# Altium schematic sheet ADC.SchDoc
size A4; SheetNumber: 4; SheetTotal: 8
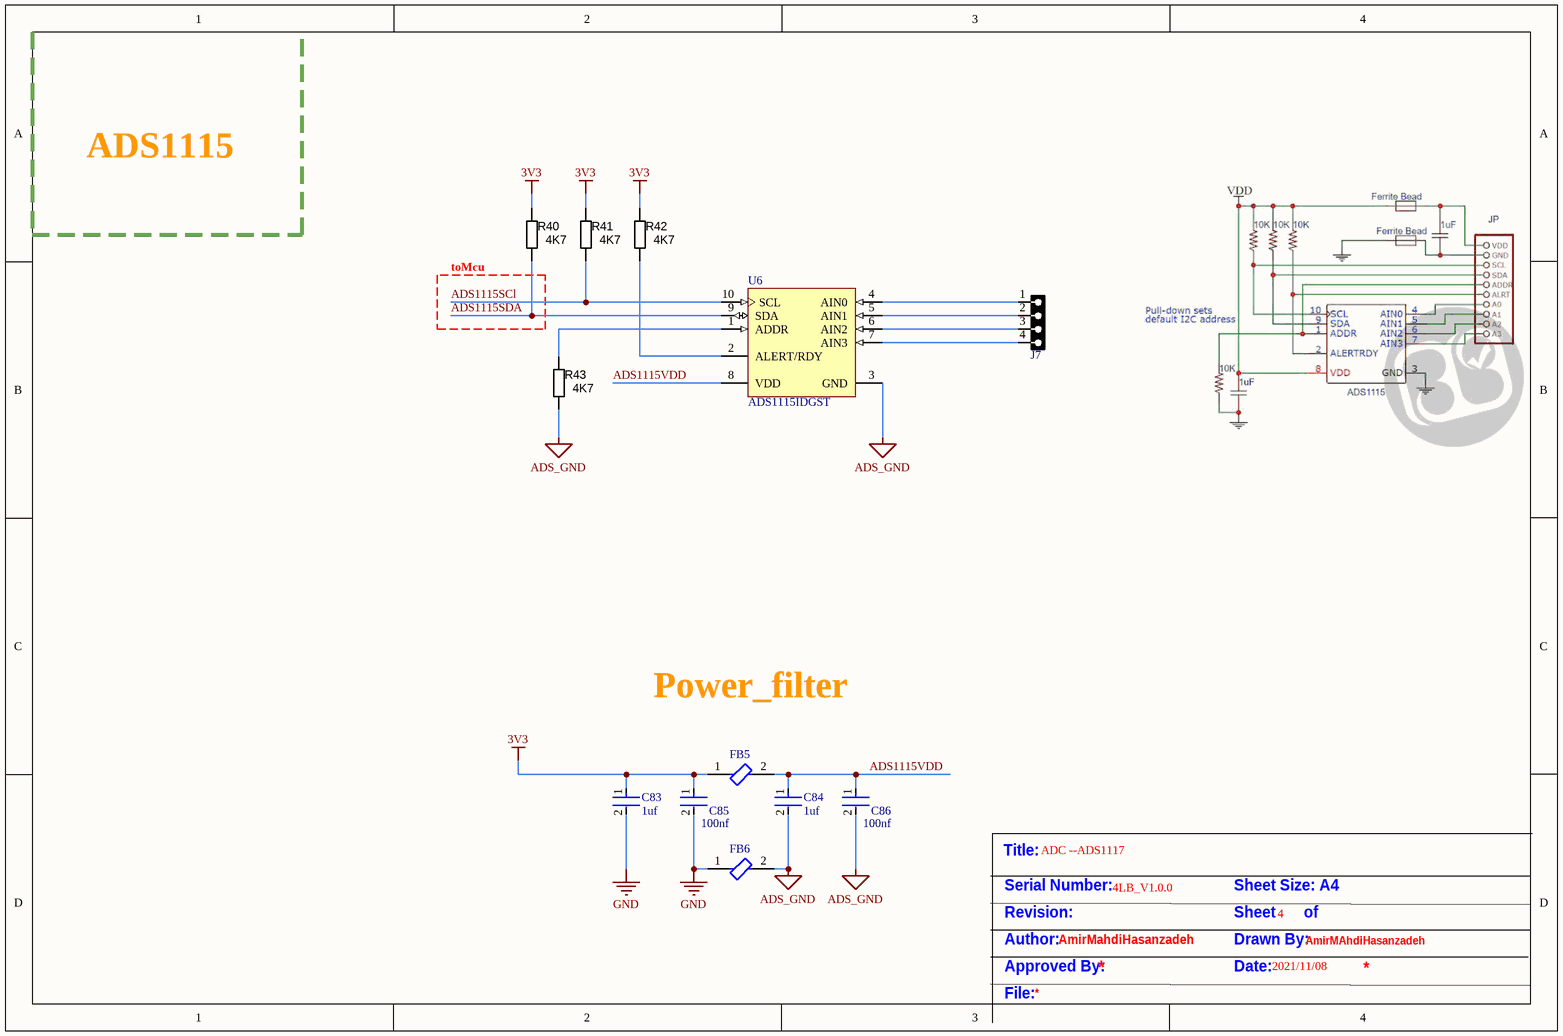
[diagram p0: ADC.SchDoc]

## Parts
C83  1uf  [FP-GRM31C-0_2-e0_3_0_8-MFG]
C84  1uf  [FP-GRM31C-0_2-e0_3_0_8-MFG]
C85  100nf  [FP-CGA3E-0_3-0_1-IPC_A]
C86  100nf  [FP-CGA3E-0_3-0_1-IPC_A]
FB5  MMZ1608R600ATA00  [FP-MMZ1608-0_8-MFG]  (value not drawn)
FB6  MMZ1608R600ATA00  [FP-MMZ1608-0_8-MFG]  (value not drawn)
J7  HDRF4  [HDR_F_1X4]  (value not drawn)
R40  value 4K7  [RESC1608X55N]  (hidden comment: Thick Film)
R41  value 4K7  [RESC1608X55N]  (hidden comment: Thick Film)
R42  value 4K7  [RESC1608X55N]  (hidden comment: Thick Film)
R43  value 4K7  [RESC1608X55N]  (hidden comment: Thick Film)
U6  ADS1115IDGST  [TI-DGS10_M]

## Nets
3V3: C83.1 C85.1 FB5.1 R40.1 R41.1 R42.1
ADS_GND: C84.2 C86.2 FB6.2 R43.2 U6.3(GND)
GND: C83.2 C85.2 FB6.1
ADS1115SCl: R41.2 U6.10(SCL)
ADS1115SDA: R40.2 U6.9(SDA)
ADS1115VDD: C84.1 C86.1 FB5.2 U6.8(VDD)
NetJ7_1: J7.1 U6.4(AIN0)
NetJ7_2: J7.2 U6.5(AIN1)
NetJ7_3: J7.3 U6.6(AIN2)
NetJ7_4: J7.4 U6.7(AIN3)
NetR42_2: R42.2 U6.2(ALERT/RDY)
NetR43_1: R43.1 U6.1(ADDR)

## Notes on the sheet
- ADS1115
- (near R40) toMcu
- Power_filter
- Title:
- ADC --ADS1117
- Serial Number:
- Revision:
- 4LB_V1.0.0
- Sheet       of
- Sheet Size: A4
- 4
- Author:
- Approved By:
- AmirMahdiHasanzadeh
- Date:
- Drawn By:
- 2021/11/08
- AmirMAhdiHasanzadeh
- File:

## Library data of the parts
C83 C84 = CMP-06035-003841-1: Chip Multilayer Ceramic Capacitors for General Purpose, 1206, 10uF, X7R, 15%, 10%, 10V; Capacitance: 22uF; Height: 1.6mm; Width: 0.063inch; Min Operating Temperature: -55°C; Package Quantity: 1; Termination: SMD/SMT; Length: 3.2mm; Voltage Rating: 10V; Case/Package: 1206; Case Code (Imperial): 1206; Depth: 1.6mm; Dielectric: X7R; Voltage: 10V; Material: Ceramic; Tolerance: 10%; Voltage Rating (DC): 10V; Lead Free: Lead Free; Max Operating Temperature: 125°C; Case Code (Metric): 3216; Packaging: Tape and Reel; Thickness: 0.071inch; Radiation Hardening: No; REACH SVHC: No SVHC; Mount: Surface Mount
C85 C86 = CMP-2000-07546-2: Cap Ceramic 100nF 50V X7R 10% Pad SMD 0603 +125°C Automotive T/R; Weight: 7.1E-05oz; Composition: Ceramic; Max Operating Temperature: 125°C; Termination: SMD/SMT; Dielectric: X7R; Length: 1.6mm; Package Quantity: 1; REACH SVHC: No SVHC; Lead Free: Lead Free; Case Code (Metric): 1608; Min Operating Temperature: -55°C; Packaging: Tape and Reel; Tolerance: 10%; Voltage Rating: 50V; Case Code (Imperial): 0603; Capacitance: 100nF; Case/Package: 0603; Voltage Rating (DC): 50V; Depth: 0.8mm; Radiation Hardening: No; Ratings: AEC-Q200; Mount: Surface Mount; Voltage: 50V; Thickness: 0.035inch; Width: 0.8mm; Height: 0.8mm
FB5 FB6 = CMP-08257-000150-1: Signal Line Ferrite Bead 60Ω  @ 100MHz 800mA DCR 100mΩ SMD 0603; DC Resistance (DCR): 100mR; Tolerance: 25%; Impedance: 60R; Width: 0.031inch; Mount: Surface Mount; Max DC Current: 800mA; Series: MMZ; RoHS Compliant: Yes; Package Quantity: 1; Current Rating: 800mA; Depth: 0.8mm; Case Code (Imperial): 0603; Length: 0.063inch; Case Code (Metric): 1608; Height: 0.037inch; Core Material: Ferrite; REACH SVHC: No SVHC; Case/Package: 0603; Packaging: Cut Tape
J7 = HDR_F_1X4: CONN, HEADER, Female, pitch: 2.54mm, 4POS; VALUE: HDRF4
R40-R43 = RES_4K7_0603_5%: Resistor SMD chip 4.7k Ohm 0.1W 5% 0603; Manufacturer 1: Vishay/Dale; Manufacturer Part Number 1: CRCW06034K70JNEA; Ratings: 1/10 W; SCDType: spec; Package / Case: 0603 (1608 metric); Tolerance: ±5%; Material: Thick Film; Supplier 1: Digi-Key; Supplier Part Number 1: 541-4.7KGCT-ND
U6 = CMP-0003-00378-2: 16-Bit ADC with Integrated Multiplexer, PGA, Comparator, Oscillator, and Reference, -40 to 125 degC, 10-pin SOP (DGS10), Green (RoHS & no Sb/Br); Manufacturer: Texas Instruments; Sample Rate (max)(SPS): 860; SubFamily: Precision ADC (<=10MSPS); Architecture: Delta-Sigma; Digital Supply(Min)(V): 2; Resolution(Bits): 16; Digital Supply(Max)(V): 5.5; INL(Max)(+/-LSB): 1; Interface: Serial I2C; # Input Channels: 4; Eco-Plan: Green (RoHS & no Sb/Br); PackageDescription: 10-Pin Plastic Small Outline, Body 3 x 3 mm, Pitch 0.5 mm; Mounting Technology: Surface Mount; PackageReference: DGS10; DatasheetVersion: SBAS444B; ComponentLink3Description: Package Specification; ComponentLink1Description: Manufacturer URL; PartNumber: ADS1115IDGST; ComponentLink3URL: http://www.ti.com/lit/ml/mpds035b/mpds035b.pdf; ComponentLink2URL: http://www.ti.com/general/docs/lit/getliterature.tsp?genericPartNumber=ADS1115&fileType=pdf; Analog Voltage AV/DD(Min)(V): 2; ComponentLink2Description: Datasheet; PackageVersion: 4073272/C, 02/2004; Analog Voltage AV/DD(Max)(V): 5.5; Code_JEDEC: MO-153; ComponentLink1URL: http://www.ti.com/